# EAGLE schematic leitorcartao (EAGLE 6.3)

## Sheet 1 of 5
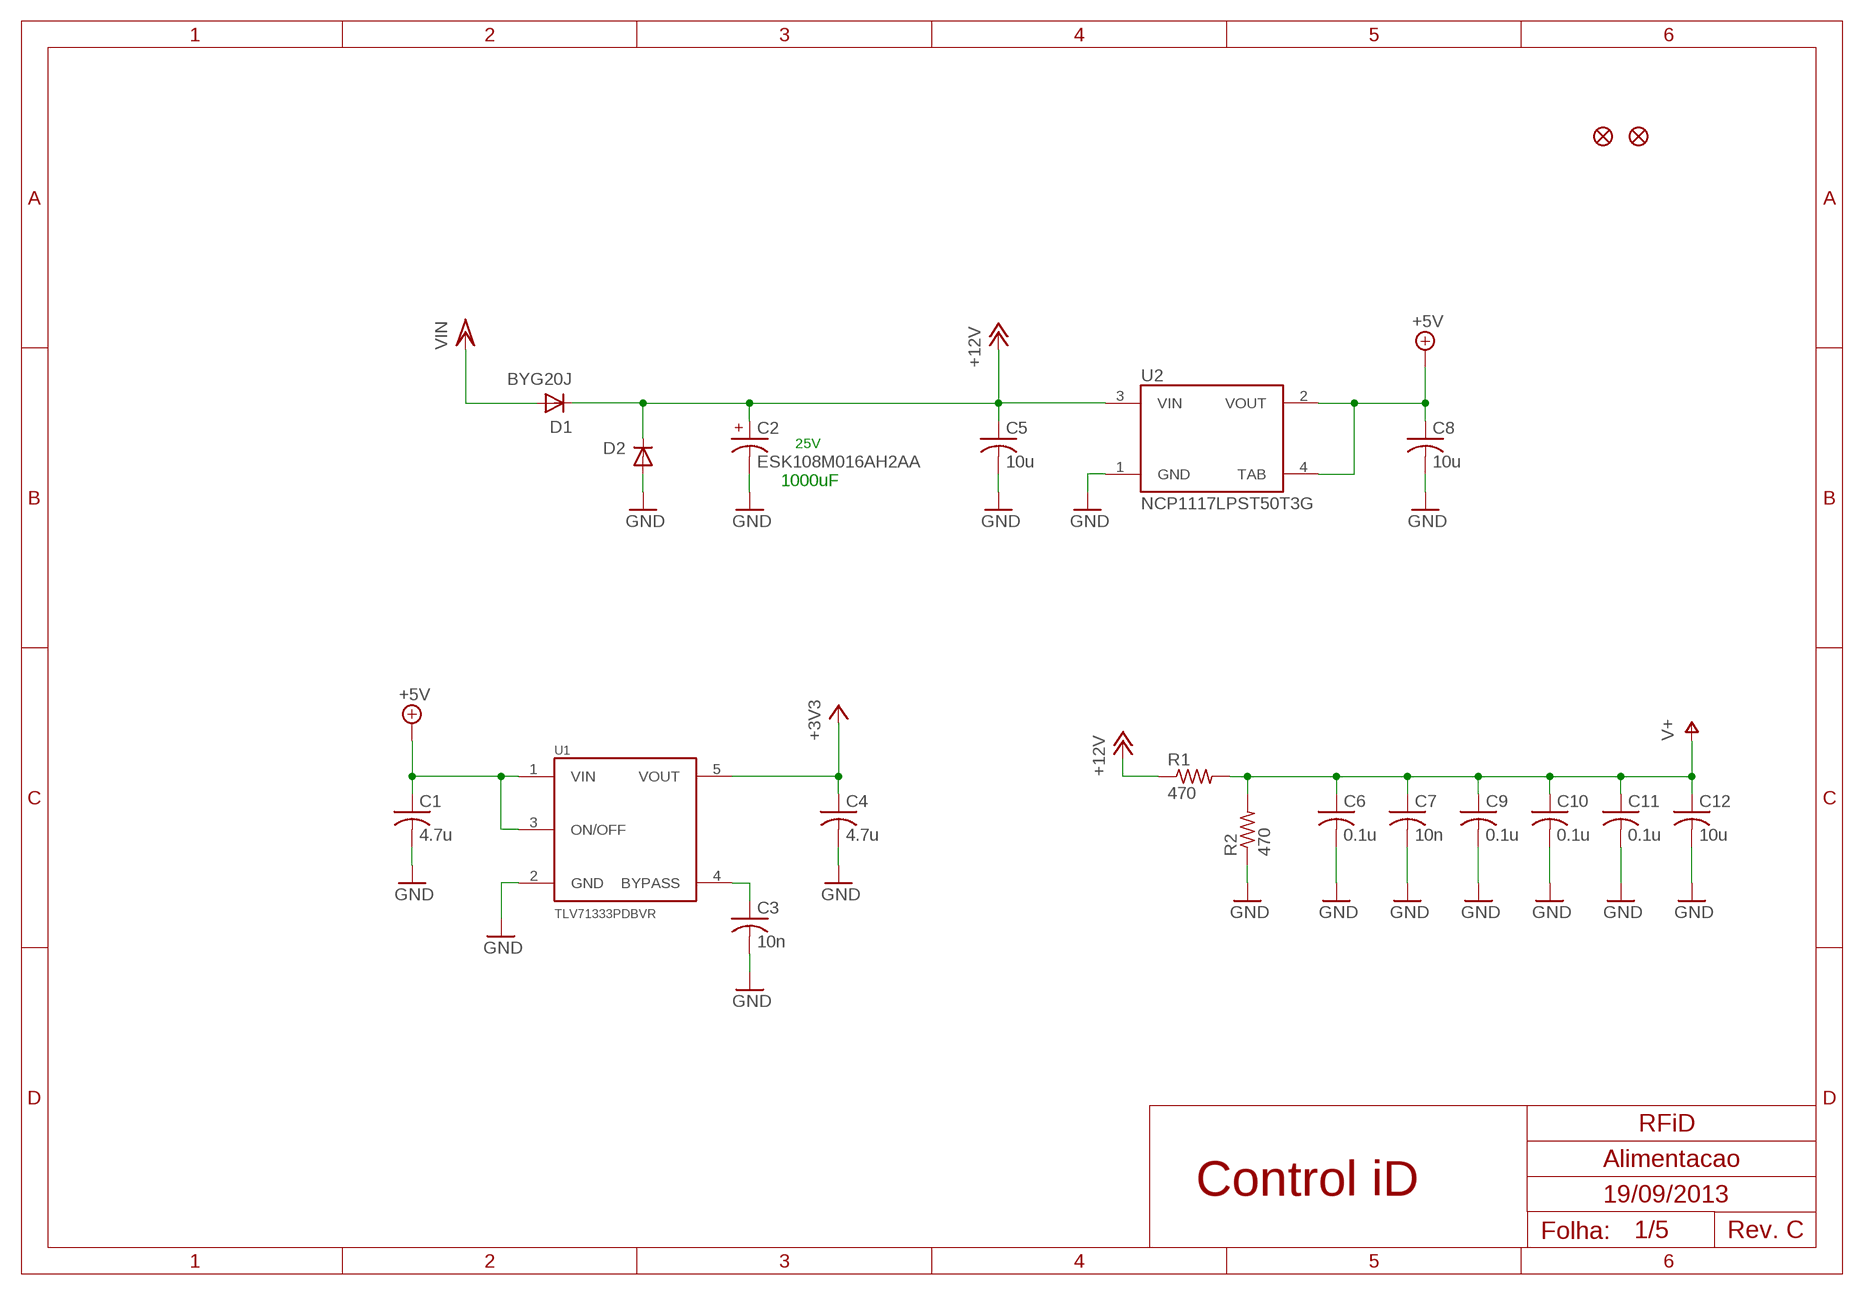
[diagram p0: schematic, sheet 1]

### Parts
C1  4.7u  C-USC0603  [C0603]
C2  ESK108M016AH2AA  [ESK108M016AH2AA]
C3  10n  C-USC0402  [C0402]
C4  4.7u  C-USC0603  [C0603]
C5  10u  C-USC0805  [C0805]
C6  0.1u  C-USC0402  [C0402]
C7  10n  C-USC0402  [C0402]
C8  10u  C-USC0805  [C0805]
C9  0.1u  C-USC0402  [C0402]
C10  0.1u  C-USC0402  [C0402]
C11  0.1u  C-USC0402  [C0402]
C12  10u  C-USC0805  [C0805]
D1  BYG20J  [SMA]
D2  DIODE-DO214AC  [DO214AC]
FID1  FIDUCIAL1.5X3  [FIDUCIAL-1.5X3]
FID3  FIDUCIAL1.5X3  [FIDUCIAL-1.5X3]
R1  470  R-US_R0402  [R0402]
R2  470  R-US_R0402  [R0402]
U1  TLV71333PDBVR  LP2985-33DBVR  [SOT-23-5]
U2  NCP1117LPST50T3G  TLV1117-50CDCYR  [SOT223-3L]

### Nets
+3V3: C4.1 U1.5(VOUT) ; also sheet 2,4,5
+5V: C1.1 C8.1 U1.1(VIN) U1.3(ON/OFF) U2.2(VOUT) U2.4(TAB) ; also sheet 5
+12V: C2.+ C5.1 D1.K D2.C R1.1 U2.3(VIN) ; also sheet 3,5
GND: C1.2 C2.- C3.2 C4.2 C5.2 C6.2 C7.2 C8.2 C9.2 C10.2 C11.2 C12.2 D2.A R2.1 U1.2(GND) U2.1(GND) ; also sheet 2,3,4,5
N$65: C3.1 U1.4(BYPASS)
V+: C6.1 C7.1 C9.1 C10.1 C11.1 C12.1 R1.2 R2.2 ; also sheet 3
VCC/2: D1.A ; supply symbol labelled VIN ; also sheet 5

### Notes on the sheet
- 25V
- 1000uF
- RFiD
- Alimentacao
- 19/09/2013
- Rev. C

## Sheet 2 of 5
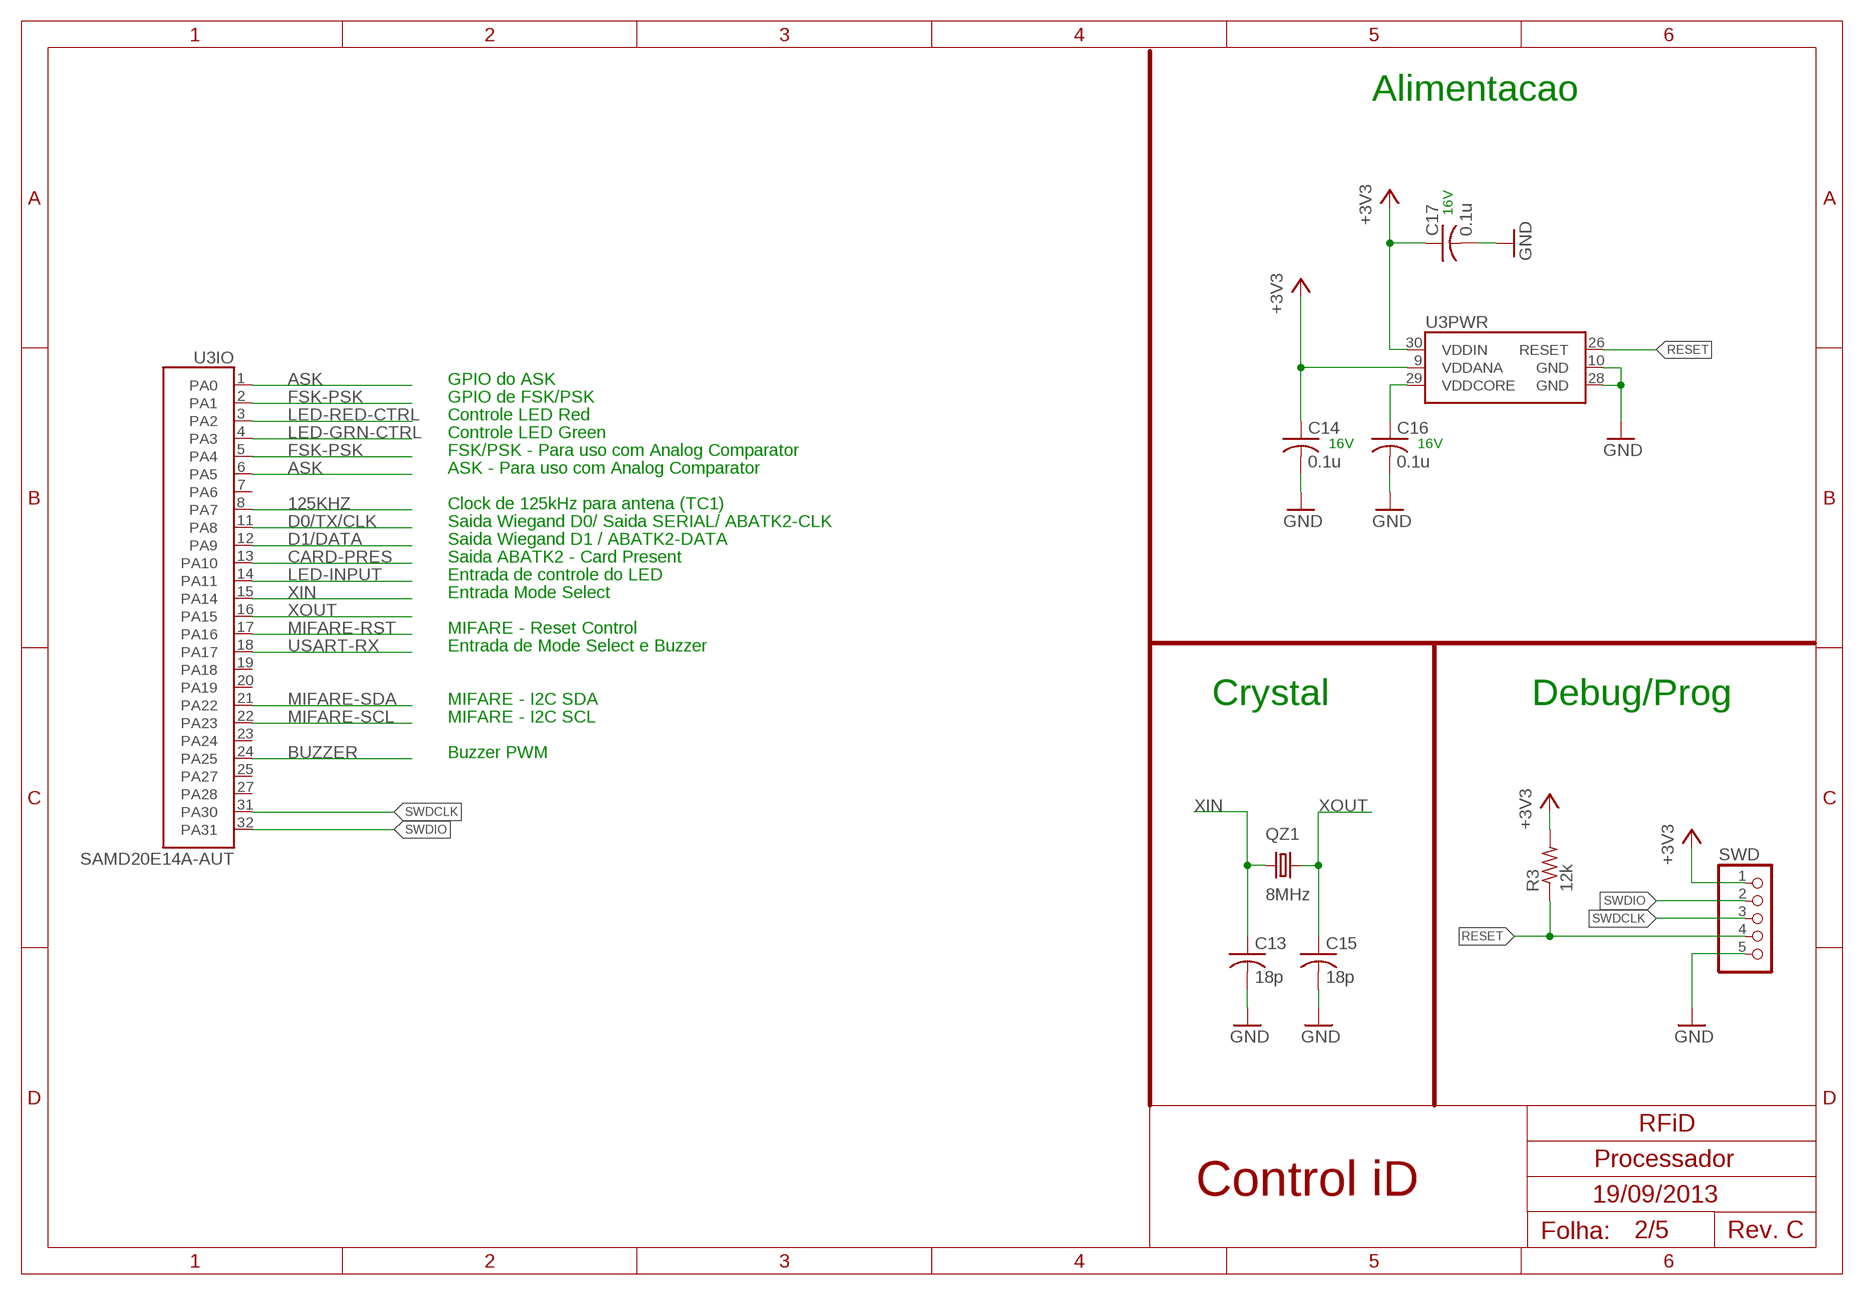
[diagram p1: schematic, sheet 2]

### Parts
C13  18p  C-USC0603  [C0603]
C14  0.1u  C-USC0402  [C0402]
C15  18p  C-USC0603  [C0603]
C16  0.1u  C-USC0402  [C0402]
C17  0.1u  C-USC0402  [C0402]
QZ1  8MHz  CRYSTALHC49S  [HC49/S]
R3  12k  R-US_R0402  [R0402]
SWD  PINHD-1X5  [1X05]
U3  SAMD20E14A-AUT  [TQFP32]

### Nets
125KHZ: U3.8(IO:PA7) ; also sheet 3
+3V3: C14.1 C17.1 R3.2 SWD.1 U3.9(PWR:VDDANA) U3.30(PWR:VDDIN) ; also sheet 1,4,5
ASK: U3.1(IO:PA0) U3.6(IO:PA5) ; also sheet 3
BUZZER: U3.24(IO:PA25) ; also sheet 5
CARD-PRES: U3.13(IO:PA10) ; also sheet 5
D0/TX/CLK: U3.11(IO:PA8) ; also sheet 5
D1/DATA: U3.12(IO:PA9) ; also sheet 5
FSK-PSK: U3.2(IO:PA1) U3.5(IO:PA4) ; also sheet 3
GND: C13.2 C14.2 C15.2 C16.2 C17.2 SWD.5 U3.10(PWR:GND) U3.28(PWR:GND) ; also sheet 1,3,4,5
LED-GRN-CTRL: U3.4(IO:PA3) ; also sheet 5
LED-INPUT: U3.14(IO:PA11) ; also sheet 5
LED-RED-CTRL: U3.3(IO:PA2) ; also sheet 5
MIFARE-RST: U3.17(IO:PA16) ; also sheet 4
MIFARE-SCL: U3.22(IO:PA23) ; also sheet 4
MIFARE-SDA: U3.21(IO:PA22) ; also sheet 4
N$47: C16.1 U3.29(PWR:VDDCORE)
RESET: R3.1 SWD.4 U3.26(PWR:RESET)
SWDCLK: SWD.3 U3.31(IO:PA30)
SWDIO: SWD.2 U3.32(IO:PA31)
USART-RX: U3.18(IO:PA17) ; also sheet 5
XIN: C13.1 QZ1.1 U3.15(IO:PA14)
XOUT: C15.1 QZ1.2 U3.16(IO:PA15)
Unconnected: U3.7(IO:PA6) U3.19(IO:PA18) U3.20(IO:PA19) U3.23(IO:PA24) U3.25(IO:PA27) U3.27(IO:PA28)

### Notes on the sheet
- Alimentacao
- 16V
- GPIO do ASK
- GPIO de FSK/PSK
- Controle LED Red
- Controle LED Green | 16V | 16V
- FSK/PSK - Para uso com Analog Comparator
- ASK - Para uso com Analog Comparator
- Clock de 125kHz para antena (TC1)
- Saida Wiegand D0/ Saida SERIAL/ ABATK2-CLK
- Saida Wiegand D1 / ABATK2-DATA
- Saida ABATK2 - Card Present
- Entrada de controle do LED
- Entrada Mode Select
- MIFARE - Reset Control
- Entrada de Mode Select e Buzzer
- MIFARE - I2C SDA | Crystal | Debug/Prog
- MIFARE - I2C SCL
- Buzzer PWM
- RFiD
- Processador
- 19/09/2013
- Rev. C

## Sheet 3 of 5
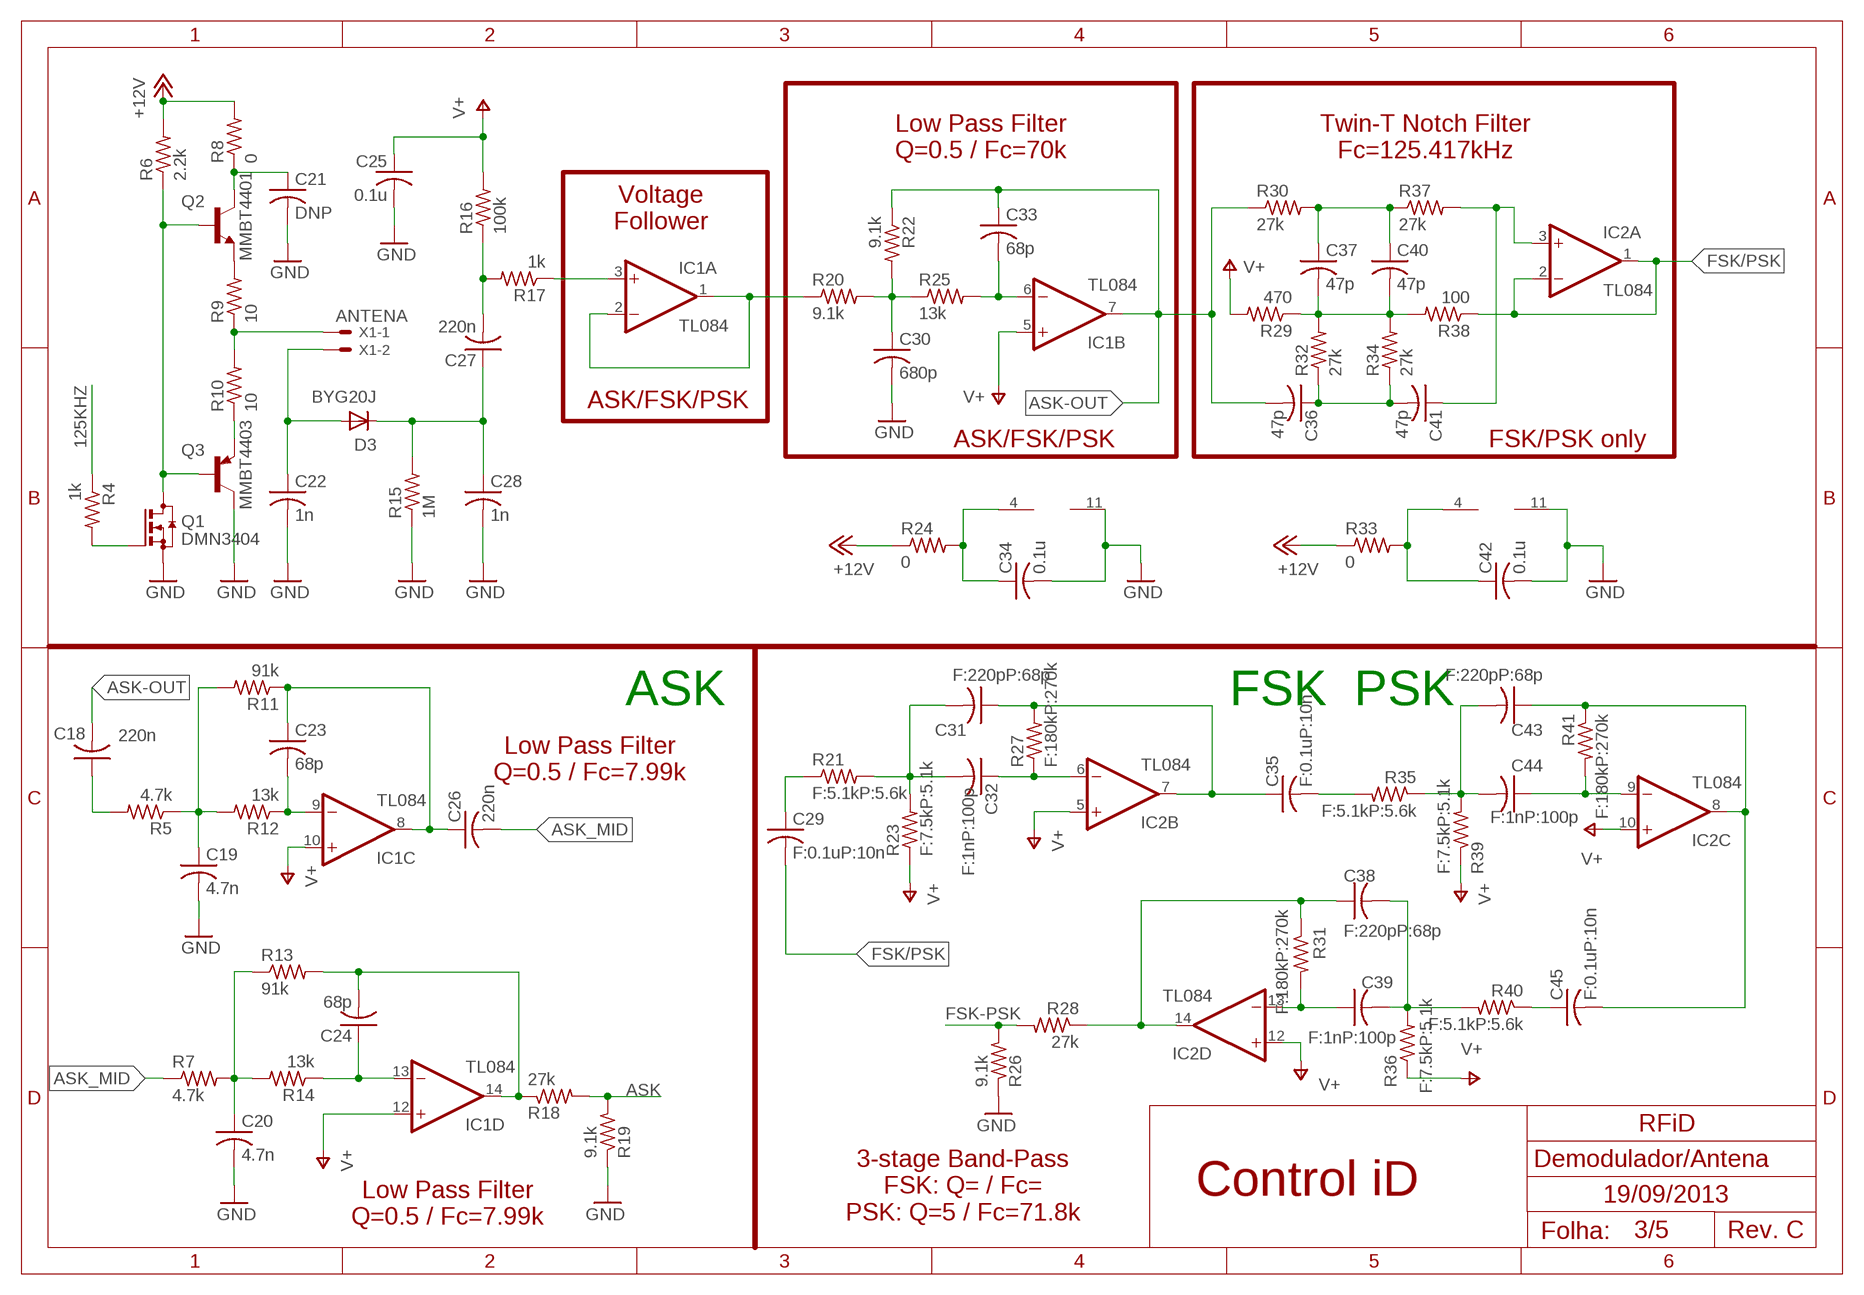
[diagram p2: schematic, sheet 3]

### Parts
C18  220n  C-USC0402  [C0402]
C19  4.7n  C-USC0402  [C0402]
C20  4.7n  C-USC0402  [C0402]
C21  DNP  C-USC0603  [C0603]
C22  1n  C-USC1812S  [C1812S]
C23  68p  C-USC0402  [C0402]
C24  68p  C-USC0402  [C0402]
C25  0.1u  C-USC0402  [C0402]
C26  220n  C-USC0402  [C0402]
C27  220n  C-USC1206S  [C1206S]
C28  1n  C-USC1206S  [C1206S]
C29  F:0.1uP:10n  C-USC0402  [C0402]
C30  680p  C-USC0402  [C0402]
C31  F:220pP:68p  C-USC0402  [C0402]
C32  F:1nP:100p  C-USC0402  [C0402]
C33  68p  C-USC0402  [C0402]
C34  0.1u  C-USC0402  [C0402]
C35  F:0.1uP:10n  C-USC0402  [C0402]
C36  47p  C-USC0402  [C0402]
C37  47p  C-USC0402  [C0402]
C38  F:220pP:68p  C-USC0402  [C0402]
C39  F:1nP:100p  C-USC0402  [C0402]
C40  47p  C-USC0402  [C0402]
C41  47p  C-USC0402  [C0402]
C42  0.1u  C-USC0402  [C0402]
C43  F:220pP:68p  C-USC0402  [C0402]
C44  F:1nP:100p  C-USC0402  [C0402]
C45  F:0.1uP:10n  C-USC0402  [C0402]
D3  BYG20J  [SMA]
IC1  TL084  [TSSOP14]
IC2  TL084  [TSSOP14]
Q1  DMN3404  [SOT23]
Q2  MMBT4401  [SOT23]
Q3  MMBT4403  [SOT23]
R4  1k  R-US_R0402  [R0402]
R5  4.7k  R-US_R0402  [R0402]
R6  2.2k  R-US_R0402  [R0402]
R7  4.7k  R-US_R0402  [R0402]
R8  0  R-US_R0402  [R0402]
R9  10  R-US_R0603  [R0603]
R10  10  R-US_R0603  [R0603]
R11  91k  R-US_R0402  [R0402]
R12  13k  R-US_R0402  [R0402]
R13  91k  R-US_R0402  [R0402]
R14  13k  R-US_R0402  [R0402]
R15  1M  R-US_R1206S  [R1206S]
R16  100k  R-US_R0603  [R0603]
R17  1k  R-US_R0402  [R0402]
R18  27k  R-US_R0402  [R0402]
R19  9.1k  R-US_R0402  [R0402]
R20  9.1k  R-US_R0402  [R0402]
R21  F:5.1kP:5.6k  R-US_R0402  [R0402]
R22  9.1k  R-US_R0402  [R0402]
R23  F:7.5kP:5.1k  R-US_R0402  [R0402]
R24  0  R-US_R0402  [R0402]
R25  13k  R-US_R0402  [R0402]
R26  9.1k  R-US_R0402  [R0402]
R27  F:180kP:270k  R-US_R0402  [R0402]
R28  27k  R-US_R0402  [R0402]
R29  470  R-US_R0402  [R0402]
R30  27k  R-US_R0402  [R0402]
R31  F:180kP:270k  R-US_R0402  [R0402]
R32  27k  R-US_R0402  [R0402]
R33  0  R-US_R0402  [R0402]
R34  27k  R-US_R0402  [R0402]
R35  F:5.1kP:5.6k  R-US_R0402  [R0402]
R36  F:7.5kP:5.1k  R-US_R0402  [R0402]
R37  27k  R-US_R0402  [R0402]
R38  100  R-US_R0603  [R0603]
R39  F:7.5kP:5.1k  R-US_R0402  [R0402]
R40  F:5.1kP:5.6k  R-US_R0402  [R0402]
R41  F:180kP:270k  R-US_R0402  [R0402]
X1  ANTENA  22-23-2021  [22-23-2021]

### Nets
125KHZ: R4.1 ; also sheet 2
+12V: R6.2 R8.2 R24.1 R33.1 ; also sheet 1,5
ASK: R18.2 R19.2 ; also sheet 2
ASK-OUT: C18.2 C33.1 C36.2 IC1.7(B:OUT) R22.1 R30.1
ASK_MID: C26.2 R7.1
FSK-PSK: R26.2 R28.2 ; also sheet 2
FSK/PSK: C29.2 IC2.1(A:OUT) IC2.2(A:-IN) R38.1
GND: C19.2 C20.2 C21.2 C22.2 C25.2 C28.2 C30.2 C34.2 C42.2 IC1.11(P:V-) IC2.11(P:V-) Q1.2(S) Q3.3(C) R15.1 R19.1 R26.1 ; also sheet 1,2,4,5
N$7: Q1.3(D) Q2.1(B) Q3.1(B) R6.1
N$8: Q1.1(G) R4.2
N$9: C22.1 D3.A X1.2
N$10: IC1.1(A:OUT) IC1.2(A:-IN) R20.1
N$11: R9.1 R10.2 X1.1
N$12: C30.1 R20.2 R22.2 R25.1
N$13: C27.1 C28.1 D3.K R15.2
N$14: C27.2 R16.1 R17.2
N$15: C33.2 IC1.6(B:-IN) R25.2
N$16: Q2.2(E) R9.2
N$17: C37.2 C40.2 R29.1 R32.2 R34.2 R38.2
N$19: C37.1 C40.1 R30.2 R37.1
N$20: C36.1 C41.2 R32.1 R34.1
N$21: C18.1 R5.2
N$22: C19.1 R5.1 R11.2 R12.2
N$23: C41.1 IC2.3(A:+IN) R37.2
N$24: C38.1 IC2.14(D:OUT) R28.1 R31.1
N$25: C35.2 R35.2
N$26: C39.1 IC2.13(D:-IN) R31.2
N$27: C23.2 IC1.9(C:-IN) R12.1
N$28: C31.2 C32.2 R21.2 R23.2
N$29: C38.2 C39.2 R36.2 R40.2
N$30: C45.1 R40.1
N$40: C43.1 C45.2 IC2.8(C:OUT) R41.1
N$48: C21.1 Q2.3(C) R8.1
N$49: C34.1 IC1.4(P:V+) R24.2
N$56: C23.1 C26.1 IC1.8(C:OUT) R11.1
N$57: C42.1 IC2.4(P:V+) R33.2
N$58: IC1.3(A:+IN) R17.1
N$60: Q3.2(E) R10.1
N$63: C20.1 R7.2 R13.1 R14.2
N$64: C24.1 IC1.13(D:-IN) R14.1
N$69: C29.1 R21.1
N$71: C31.1 C35.1 IC2.7(B:OUT) R27.2
N$72: C32.1 IC2.6(B:-IN) R27.1
N$74: C43.2 C44.2 R35.1 R39.2
N$75: C44.1 IC2.9(C:-IN) R41.2
N$90: C24.2 IC1.14(D:OUT) R13.2 R18.1
V+: C25.1 IC1.5(B:+IN) IC1.10(C:+IN) IC1.12(D:+IN) IC2.5(B:+IN) IC2.10(C:+IN) IC2.12(D:+IN) R16.2 R23.1 R29.2 R36.1 R39.1 ; also sheet 1

### Notes on the sheet
- Low Pass Filter
  Q=0.5 / Fc=70k
- Twin-T Notch Filter
  Fc=125.417kHz
- Voltage
  Follower
- ASK/FSK/PSK
- ASK/FSK/PSK | FSK/PSK only
- ASK | FSK | PSK
- Low Pass Filter
  Q=0.5 / Fc=7.99k
- RFiD
- Demodulador/Antena
- 3-stage Band-Pass
  FSK: Q= / Fc=
  PSK: Q=5 / Fc=71.8k
- Low Pass Filter
  Q=0.5 / Fc=7.99k
- 19/09/2013
- Rev. C

## Sheet 4 of 5
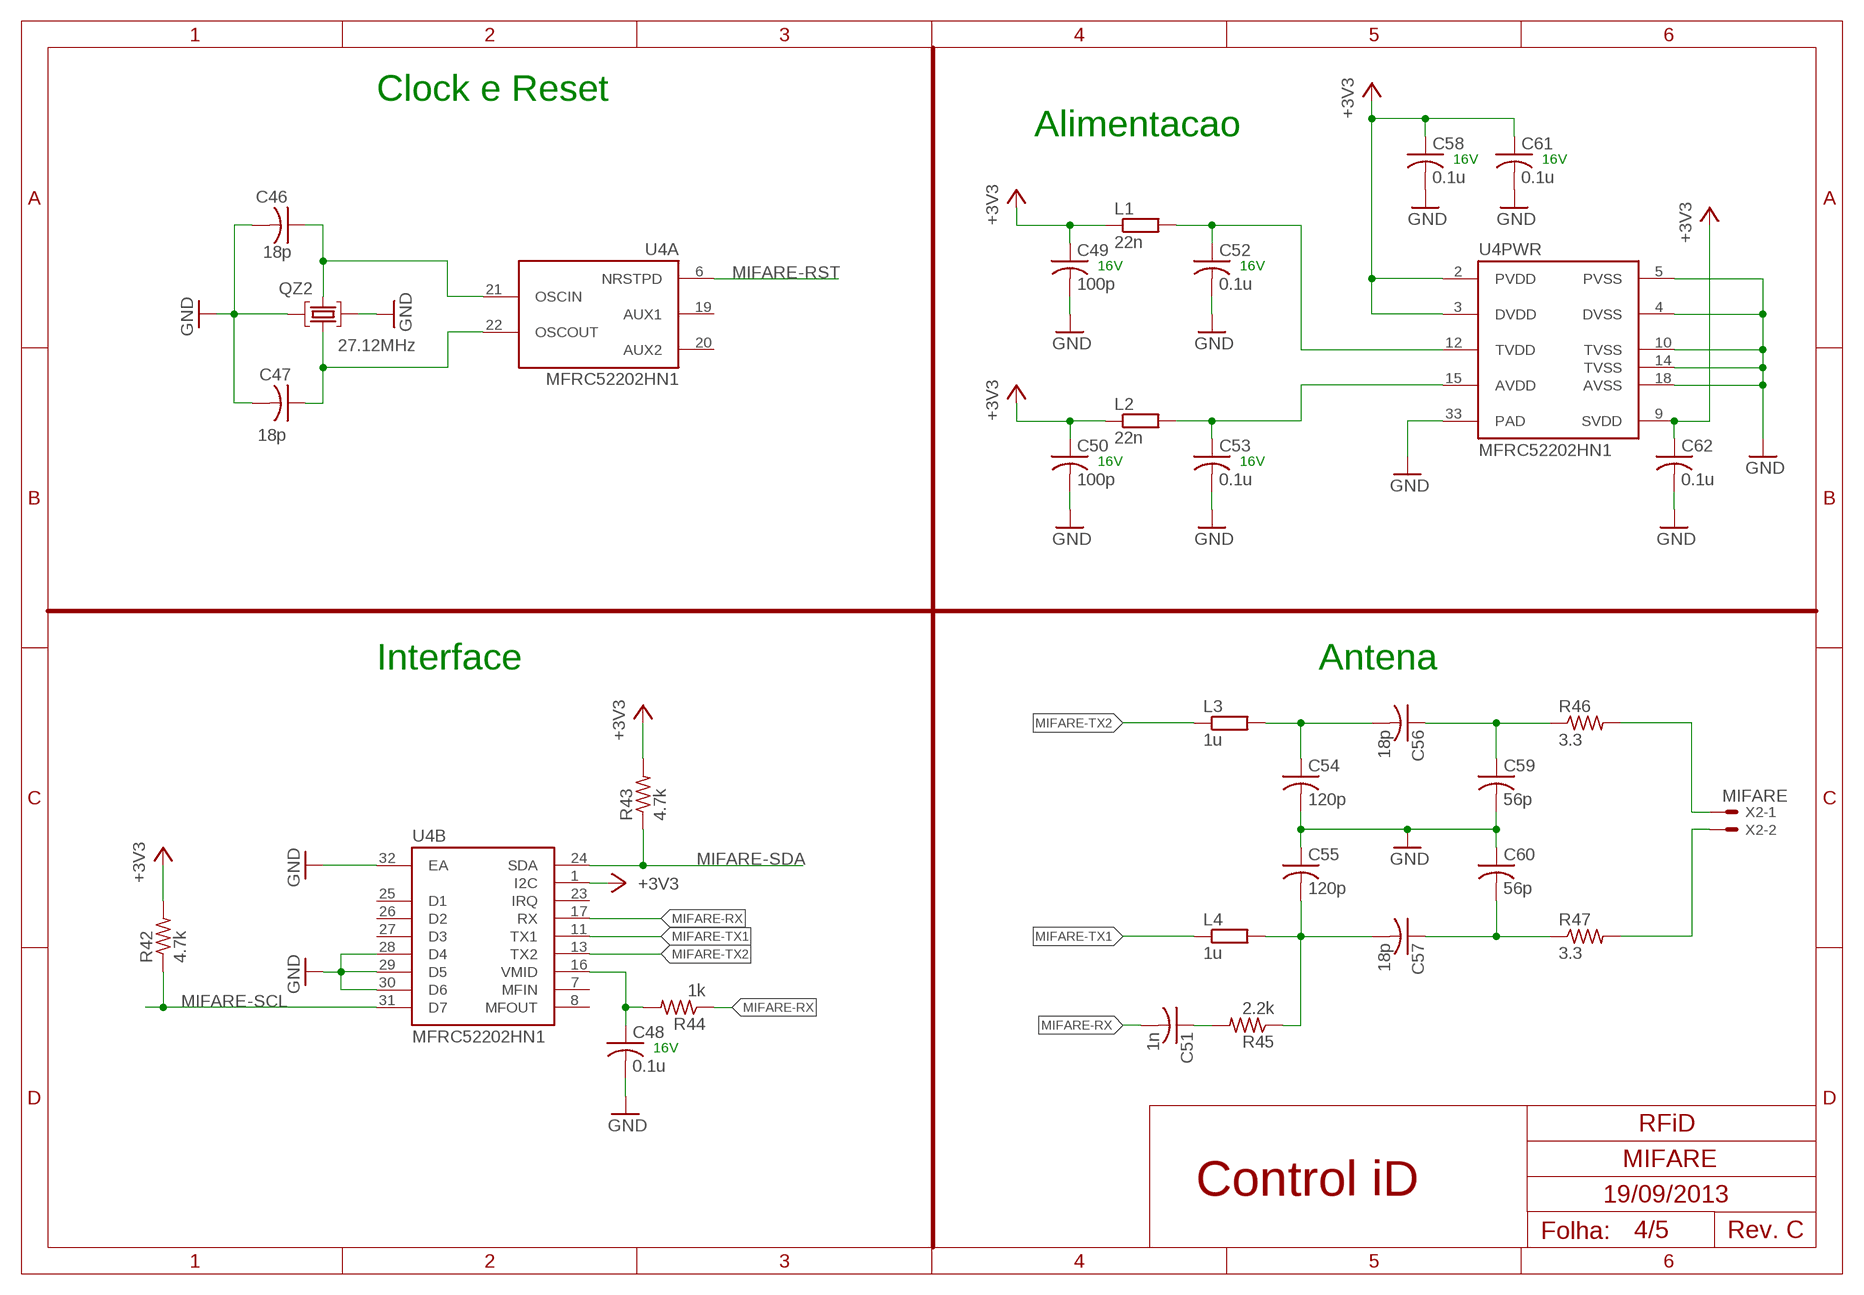
[diagram p3: schematic, sheet 4]

### Parts
C46  18p  C-USC0603  [C0603]
C47  18p  C-USC0603  [C0603]
C48  0.1u  C-USC0402  [C0402]
C49  100p  C-USC0402  [C0402]
C50  100p  C-USC0402  [C0402]
C51  1n  C-USC0402  [C0402]
C52  0.1u  C-USC0402  [C0402]
C53  0.1u  C-USC0402  [C0402]
C54  120p  C-USC0603  [C0603]
C55  120p  C-USC0603  [C0603]
C56  18p  C-USC0603  [C0603]
C57  18p  C-USC0603  [C0603]
C58  0.1u  C-USC0402  [C0402]
C59  56p  C-USC0603  [C0603]
C60  56p  C-USC0603  [C0603]
C61  0.1u  C-USC0402  [C0402]
C62  0.1u  C-USC0402  [C0402]
L1  22n  R-EU_R0402  [R0402]
L2  22n  R-EU_R0402  [R0402]
L3  1u  R-EU_R0603  [R0603]
L4  1u  R-EU_R0603  [R0603]
QZ2  27.12MHz  CRISTAL  [CRISTAL4SMD]
R42  4.7k  R-US_R0402  [R0402]
R43  4.7k  R-US_R0402  [R0402]
R44  1k  R-US_R0402  [R0402]
R45  2.2k  R-US_R0402  [R0402]
R46  3.3  R-US_R0603  [R0603]
R47  3.3  R-US_R0603  [R0603]
U4  MFRC52202HN1  [QFN32]
X2  MIFARE  ANTENA  [ANTENNA]

### Nets
+3V3: C49.1 C50.1 C58.1 C61.1 C62.1 L1.1 L2.1 R42.2 R43.2 U4.1(B:I2C) U4.2(PWR:PVDD) U4.3(PWR:DVDD) U4.9(PWR:SVDD) ; also sheet 1,2,5
GND: C46.2 C47.2 C48.2 C49.2 C50.2 C52.2 C53.2 C54.2 C55.1 C58.2 C59.2 C60.1 C61.2 C62.2 QZ2.2(GND) QZ2.4(GND) U4.4(PWR:DVSS) U4.5(PWR:PVSS) U4.10(PWR:TVSS) U4.14(PWR:TVSS) U4.18(PWR:AVSS) U4.28(B:D4) U4.29(B:D5) U4.30(B:D6) U4.32(B:EA) U4.33(PWR:PAD) ; also sheet 1,2,3,5
MIFARE-RST: U4.6(A:NRSTPD) ; also sheet 2
MIFARE-RX: C51.2 R44.1 U4.17(B:RX)
MIFARE-SCL: R42.1 U4.31(B:D7) ; also sheet 2
MIFARE-SDA: R43.1 U4.24(B:SDA) ; also sheet 2
MIFARE-TX1: L4.1 U4.11(B:TX1)
MIFARE-TX2: L3.1 U4.13(B:TX2)
N$2: C52.1 L1.2 U4.12(PWR:TVDD)
N$3: C46.1 QZ2.3 U4.21(A:OSCIN)
N$4: C53.1 L2.2 U4.15(PWR:AVDD)
N$5: C47.1 QZ2.1 U4.22(A:OSCOUT)
N$31: C55.2 C57.2 L4.2 R45.1
N$33: C57.1 C60.2 R47.1
N$34: C54.1 C56.2 L3.2
N$35: C56.1 C59.1 R46.1
N$36: C51.1 R45.2
N$37: C48.1 R44.2 U4.16(B:VMID)
N$38: R46.2 X2.1
N$39: R47.2 X2.2
Unconnected: U4.7(B:MFIN) U4.8(B:MFOUT) U4.19(A:AUX1) U4.20(A:AUX2) U4.23(B:IRQ) U4.25(B:D1) U4.26(B:D2) U4.27(B:D3)

### Notes on the sheet
- Clock e Reset
- Alimentacao
- 16V | 16V
- 16V | 16V
- 16V | 16V
- Interface | Antena
- 16V
- RFiD
- MIFARE
- 19/09/2013
- Rev. C

## Sheet 5 of 5
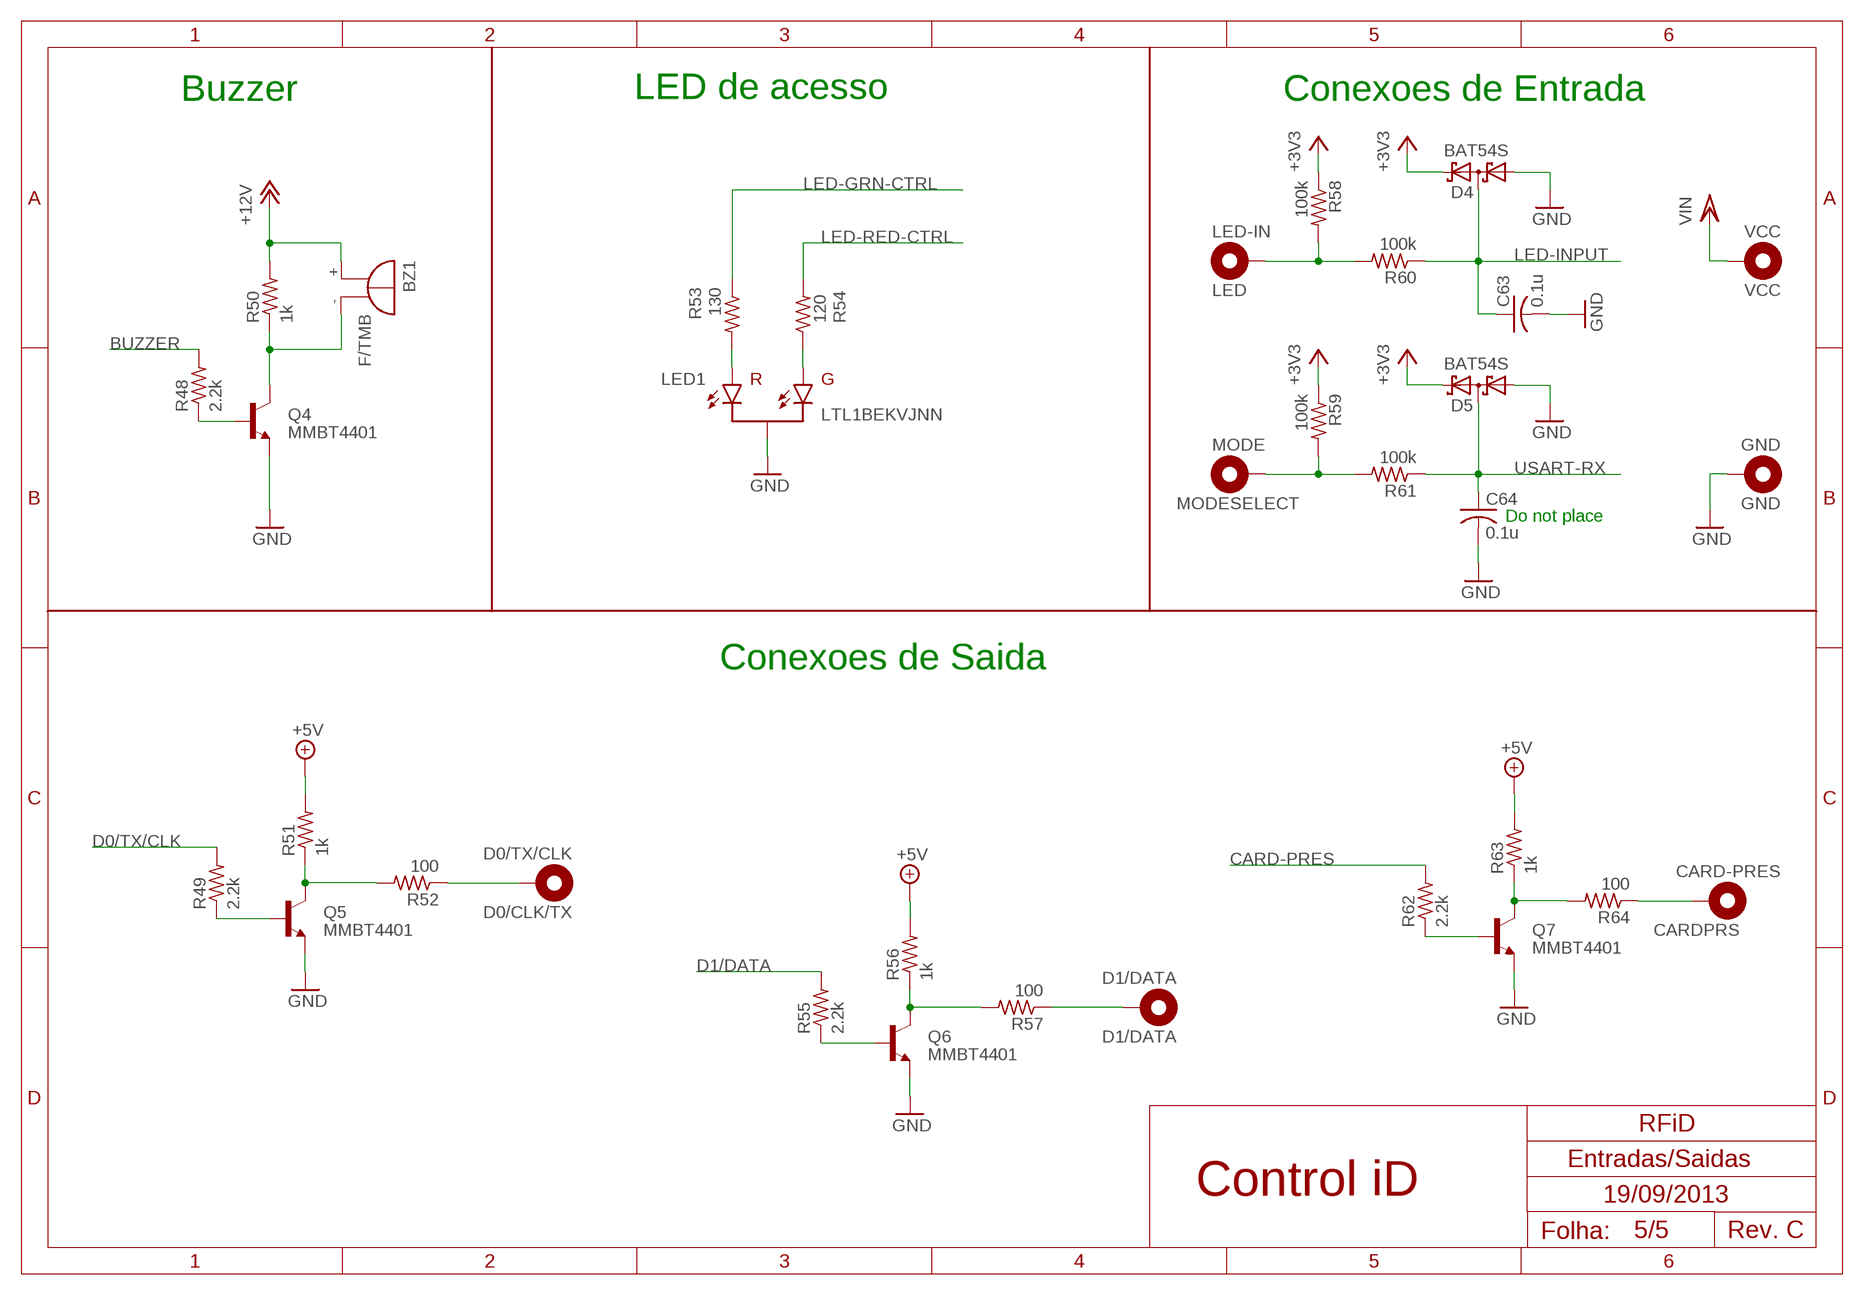
[diagram p4: schematic, sheet 5]

### Parts
BZ1  F/TMB  [F/TMB]
C63  0.1u  C-USC0402  [C0402]
C64  0.1u  C-USC0402  [C0402]
CARDPRS  CARD-PRES  PTHPAD  [HOLE]
D0/TX/CLK  D0/CLK/TX  PTHPAD  [HOLE]
D1/DATA  D1/DATA  PTHPAD  [HOLE]
D4  BAT54S  [SOT23]
D5  BAT54S  [SOT23]
GND  GND  PTHPAD  [HOLE]
LED1  LTL1BEKVJNN  [LTL1BEKVJNN]
LED-IN  LED  PTHPAD  [HOLE]
MODE  MODESELECT  PTHPAD  [HOLE]
Q4  MMBT4401  [SOT23]
Q5  MMBT4401  [SOT23]
Q6  MMBT4401  [SOT23]
Q7  MMBT4401  [SOT23]
R48  2.2k  R-US_R0402  [R0402]
R49  2.2k  R-US_R0402  [R0402]
R50  1k  R-US_R0402  [R0402]
R51  1k  R-US_R0402  [R0402]
R52  100  R-US_R0603  [R0603]
R53  130  R-US_R0402  [R0402]
R54  120  R-US_R0402  [R0402]
R55  2.2k  R-US_R0402  [R0402]
R56  1k  R-US_R0402  [R0402]
R57  100  R-US_R0603  [R0603]
R58  100k  R-US_R0603  [R0603]
R59  100k  R-US_R0603  [R0603]
R60  100k  R-US_R0603  [R0603]
R61  100k  R-US_R0603  [R0603]
R62  2.2k  R-US_R0402  [R0402]
R63  1k  R-US_R0402  [R0402]
R64  100  R-US_R0603  [R0603]
VCC  VCC  PTHPAD  [HOLE]

### Nets
+3V3: D4.2(C2) D5.2(C2) R58.1 R59.1 ; also sheet 1,2,4
+5V: R51.2 R56.2 R63.2 ; also sheet 1
+12V: BZ1.+ R50.2 ; also sheet 1,3
BUZZER: R48.2 ; also sheet 2
CARD-PRES: R62.2 ; also sheet 2
D0/TX/CLK: R49.2 ; also sheet 2
D1/DATA: R55.2 ; also sheet 2
GND: C63.2 C64.2 D4.1(A1) D5.1(A1) GND.P$1 LED1.COMMON Q4.2(E) Q5.2(E) Q6.2(E) Q7.2(E) ; also sheet 1,2,3,4
LED-GRN-CTRL: R53.1 ; also sheet 2
LED-INPUT: C63.1 D4.3(C1A2) R60.1 ; also sheet 2
LED-RED-CTRL: R54.2 ; also sheet 2
N$6: Q6.1(B) R55.1
N$18: LED-IN.P$1 R58.2 R60.2
N$32: Q5.1(B) R49.1
N$41: Q6.3(C) R56.1 R57.2
N$42: Q7.3(C) R63.1 R64.2
N$43: MODE.P$1 R59.2 R61.2
N$44: Q7.1(B) R62.1
N$45: Q5.3(C) R51.1 R52.2
N$46: D0/TX/CLK.P$1 R52.1
N$50: D1/DATA.P$1 R57.1
N$51: CARDPRS.P$1 R64.1
N$52: LED1.ANODE_RED R53.2
N$53: LED1.ANODE_GRN R54.1
N$54: BZ1.- Q4.3(C) R50.1
N$55: Q4.1(B) R48.1
USART-RX: C64.1 D5.3(C1A2) R61.1 ; also sheet 2
VCC/2: VCC.P$1 ; supply symbol labelled VIN ; also sheet 1

### Notes on the sheet
- Buzzer | LED de acesso | Conexoes de Entrada
- Do not place
- Conexoes de Saida
- RFiD
- Entradas/Saidas
- 19/09/2013
- Rev. C

## Library data of the parts
BZ1 = RFiD:F/TMB: BUZZER Source: Buerklin; ASK: X; ASK_CUSTOMERPN: BUZ-REP; ASK_PN: PS1240P02BT; FSK: X; FSK_CUSTOMERPN: BUZ-REP; FSK_PN: PS1240P02BT; MIFARE: X; MIFARE_CUSTOMERPN: BUZ-REP; MIFARE_PN: PS1240P02BT; PSK: X; PSK_CUSTOMERPN: BUZ-REP; PSK_PN: PS1240P02BT
C1 C4 = RFiD:C-US: CAPACITOR, American symbol; ASK: X; ASK_CUSTOMERPN: C/4.7u/16V/C06; ASK_PN: CL10A475KO8NNNC; FSK: X; FSK_CUSTOMERPN: C/4.7u/16V/C06; FSK_PN: CL10A475KO8NNNC; MIFARE: X; MIFARE_CUSTOMERPN: C/4.7u/16V/C06; MIFARE_PN: CL10A475KO8NNNC; PASSIVO: Sim; PSK: X; PSK_CUSTOMERPN: C/4.7u/16V/C06; PSK_PN: CL10A475KO8NNNC
C2 = RFiD:ESK108M016AH2AA; ASK: X; ASK_CUSTOMERPN: C/1m/16V/PTH; ASK_PN: ESK108M016AH2AA; FSK: X; FSK_CUSTOMERPN: C/1m/16V/PTH; FSK_PN: ESK108M016AH2AA; MIFARE: X; MIFARE_CUSTOMERPN: C/1m/16V/PTH; MIFARE_PN: ESK108M016AH2AA; PASSIVO: Sim; PSK: X; PSK_CUSTOMERPN: C/1m/16V/PTH; PSK_PN: ESK108M016AH2AA
C3 C7 = RFiD:C-US: CAPACITOR, American symbol; ASK: X; ASK_CUSTOMERPN: C/10n/50V/C04; ASK_PN: CL05B103KB5NNNC; FSK: X; FSK_CUSTOMERPN: C/10n/50V/C04; FSK_PN: CL05B103KB5NNNC; MIFARE: X; MIFARE_CUSTOMERPN: C/10n/50V/C04; MIFARE_PN: CL05B103KB5NNNC; PASSIVO: Sim; PSK: X; PSK_CUSTOMERPN: C/10n/50V/C04; PSK_PN: CL05B103KB5NNNC
C5 C8 C12 = RFiD:C-US: CAPACITOR, American symbol; ASK: X; ASK_CUSTOMERPN: C/10u/25V/A08; ASK_PN: GRM188R61E106MA73D; FSK: X; FSK_CUSTOMERPN: C/10u/25V/A08; FSK_PN: GRM188R61E106MA73D; MIFARE: X; MIFARE_CUSTOMERPN: C/10u/25V/A08; MIFARE_PN: GRM188R61E106MA73D; PASSIVO: Sim; PSK: X; PSK_CUSTOMERPN: C/10u/25V/A08; PSK_PN: GRM188R61E106MA73D
C6 C9-C11 C14 C16 C17 C25 C34 C42 C63 = RFiD:C-US: CAPACITOR, American symbol; ASK: X; ASK_CUSTOMERPN: C/0.1u/16V/A04; ASK_PN: CL05B104KO5NNNC; FSK: X; FSK_CUSTOMERPN: C/0.1u/16V/A04; FSK_PN: CL05B104KO5NNNC; MIFARE: X; MIFARE_CUSTOMERPN: C/0.1u/16V/A04; MIFARE_PN: CL05B104KO5NNNC; PASSIVO: Sim; PSK: X; PSK_CUSTOMERPN: C/0.1u/16V/A04; PSK_PN: CL05B104KO5NNNC
C13 C15 = RFiD:C-US: CAPACITOR, American symbol; ASK: X; ASK_CUSTOMERPN: C/18p/100V/E06; ASK_PN: 06031U180FAT2A; FSK: X; FSK_CUSTOMERPN: C/18p/100V/E06; FSK_PN: 06031U180FAT2A; MIFARE: X; MIFARE_CUSTOMERPN: C/18p/100V/E06; MIFARE_PN: 06031U180FAT2A; PASSIVO: Sim; PSK: X; PSK_CUSTOMERPN: C/18p/100V/E06; PSK_PN: 06031U180FAT2A
C18 C26 = RFiD:C-US: CAPACITOR, American symbol; ASK: X; ASK_CUSTOMERPN: C/220n/25V/C04; ASK_PN: C1005X5R1E224K050BC; FSK: X; FSK_CUSTOMERPN: C/220n/25V/C04; FSK_PN: C1005X5R1E224K050BC; MIFARE: X; MIFARE_CUSTOMERPN: C/220n/25V/C04; MIFARE_PN: C1005X5R1E224K050BC; PASSIVO: Sim; PSK: X; PSK_CUSTOMERPN: C/220n/25V/C04; PSK_PN: C1005X5R1E224K050BC
C19 C20 = RFiD:C-US: CAPACITOR, American symbol; ASK: X; ASK_CUSTOMERPN: C/4.7n/25V/D04; ASK_PN: C0402C472J3RACTU; FSK: X; FSK_CUSTOMERPN: C/4.7n/25V/D04; FSK_PN: C0402C472J3RACTU; MIFARE: X; MIFARE_CUSTOMERPN: C/4.7n/25V/D04; MIFARE_PN: C0402C472J3RACTU; PASSIVO: Sim; PSK: X; PSK_CUSTOMERPN: C/4.7n/25V/D04; PSK_PN: C0402C472J3RACTU
C21 = RFiD:C-US: CAPACITOR, American symbol; ASK: X; ASK_CUSTOMERPN: DNP; FSK: X; FSK_CUSTOMERPN: DNP; MIFARE: X; MIFARE_CUSTOMERPN: DNP; PASSIVO: Sim; PSK: X; PSK_PN: DNP
C22 = RFiD:C-US: CAPACITOR, American symbol; ASK: X; ASK_CUSTOMERPN: C/1n/500V/E18; ASK_PN: C1812C102FBGACTU; FSK: X; FSK_CUSTOMERPN: C/1n/500V/E18; FSK_PN: C1812C102FBGACTU; MIFARE: X; MIFARE_CUSTOMERPN: C/1n/500V/E18; MIFARE_PN: C1812C102FBGACTU; PASSIVO: Sim; PSK: X; PSK_CUSTOMERPN: C/1n/500V/E18; PSK_PN: C1812C102FBGACTU
C23 C24 C33 = RFiD:C-US: CAPACITOR, American symbol; ASK: X; ASK_CUSTOMERPN: C/68p/25V/D04; ASK_PN: CL05C680JB5NNNC; FSK: X; FSK_CUSTOMERPN: C/68p/25V/D04; FSK_PN: CL05C680JB5NNNC; MIFARE: X; MIFARE_CUSTOMERPN: C/68p/25V/D04; MIFARE_PN: CL05C680JB5NNNC; PASSIVO: Sim; PSK: X; PSK_CUSTOMERPN: C/68p/25V/D04; PSK_PN: CL05C680JB5NNNC
C27 = RFiD:C-US: CAPACITOR, American symbol; ASK: X; ASK_CUSTOMERPN: C/220n/200V/C12; ASK_PN: C3216X7T2E224K160AA; FSK: X; FSK_CUSTOMERPN: C/220n/200V/C12; FSK_PN: C3216X7T2E224K160AA; MIFARE: X; MIFARE_CUSTOMERPN: C/220n/200V/C12; MIFARE_PN: C3216X7T2E224K160AA; PASSIVO: Sim; PSK: X; PSK_CUSTOMERPN: C/220n/200V/C12; PSK_PN: C3216X7T2E224K160AA
C28 = RFiD:C-US: CAPACITOR, American symbol; ASK: X; ASK_CUSTOMERPN: C/1n/200V/C12; ASK_PN: CL31C102JHHNFNE; FSK: X; FSK_CUSTOMERPN: C/1n/200V/C12; FSK_PN: CL31C102JHHNFNE; MIFARE: X; MIFARE_CUSTOMERPN: C/1n/200V/C12; MIFARE_PN: CL31C102JHHNFNE; PASSIVO: Sim; PSK: X; PSK_CUSTOMERPN: C/1n/200V/C12; PSK_PN: CL31C102JHHNFNE
C29 C35 C45 = RFiD:C-US: CAPACITOR, American symbol; FSK: X; FSK_CUSTOMERPN: C/0.1u/16V/A04; FSK_PN: CL05B104KO5NNNC; PASSIVO: Sim; PSK: X; PSK_CUSTOMERPN: C/10n/50V/C04; PSK_PN: CL05B103KB5NNNC
C30 = RFiD:C-US: CAPACITOR, American symbol; ASK: X; ASK_CUSTOMERPN: C/680p/25V/C04; ASK_PN: CL05B681KB5NNNC; FSK: X; FSK_CUSTOMERPN: C/680p/25V/C04; FSK_PN: CL05B681KB5NNNC; MIFARE: X; MIFARE_CUSTOMERPN: C/680p/25V/C04; MIFARE_PN: CL05B681KB5NNNC; PASSIVO: Sim; PSK: X; PSK_CUSTOMERPN: C/680p/25V/C04; PSK_PN: CL05B681KB5NNNC
C31 C38 = RFiD:C-US: CAPACITOR, American symbol; FSK: X; FSK_CUSTOMERPN: C/220p/25V/D04; FSK_PN: CL05C221JB5NNNC; PASSIVO: Sim; PSK: X; PSK_CUSTOMERPN: C/68p/25V/D04; PSK_PN: CL05C680JB5NNNC
C32 C39 C44 = RFiD:C-US: CAPACITOR, American symbol; FSK: X; FSK_CUSTOMERPN: C/1n/25V/D04; FSK_PN: CL05B102JB5NFNC; PASSIVO: Sim; PSK: X; PSK_CUSTOMERPN: C/100p/50V/D04; PSK_PN: CL05C101JB5NNNC
C36 C37 C40 C41 = RFiD:C-US: CAPACITOR, American symbol; FSK: X; FSK_CUSTOMERPN: C/47p/25V/E04; FSK_PN: CL05C470FB5NNNC; PASSIVO: Sim; PSK: X; PSK_CUSTOMERPN: C/47p/25V/E04; PSK_PN: CL05C470FB5NNNC
C43 = RFiD:C-US: CAPACITOR, American symbol; FSK: X; FSK_CUSTOMERPN: C/220p/25V/D04; FSK_PN: CL05C221JB5NNNC; PASSIVO: Sim; PSK: X; PSK_CUSTOMERPN: C/680p/25V/C04; PSK_PN: CL05B681KB5NNNC
C46 C47 C56 C57 = RFiD:C-US: CAPACITOR, American symbol; MIFARE: X; MIFARE_CUSTOMERPN: C/18p/100V/E06; MIFARE_PN: 06031U180FAT2A; PASSIVO: Sim
C48 C52 C53 C58 C61 C62 = RFiD:C-US: CAPACITOR, American symbol; MIFARE: X; MIFARE_CUSTOMERPN: C/0.1u/16V/A04; MIFARE_PN: CL05B104KO5NNNC; PASSIVO: Sim
C49 C50 = RFiD:C-US: CAPACITOR, American symbol; MIFARE: X; MIFARE_CUSTOMERPN: C/100p/50V/D04; MIFARE_PN: CL05C101JB5NNNC; PASSIVO: Sim
C51 = RFiD:C-US: CAPACITOR, American symbol; MIFARE: X; MIFARE_CUSTOMERPN: C/1n/100V/D04; MIFARE_PN: C0402C102J1GACTU; PASSIVO: Sim
C54 C55 = RFiD:C-US: CAPACITOR, American symbol; MIFARE: X; MIFARE_CUSTOMERPN: C/120p/100V/E06; MIFARE_PN: GRM1885C2A121FA01J; PASSIVO: Sim
C59 C60 = RFiD:C-US: CAPACITOR, American symbol; MIFARE: X; MIFARE_CUSTOMERPN: C/56p/100V/E06; MIFARE_PN: 06031U560FAT2A; PASSIVO: Sim
C64 = RFiD:C-US: CAPACITOR, American symbol; ASK: X; ASK_CUSTOMERPN: DNP; ASK_PN: CL05B104KO5NNNC; FSK: X; FSK_CUSTOMERPN: DNP; FSK_PN: CL05B104KO5NNNC; MIFARE: X; MIFARE_CUSTOMERPN: DNP; MIFARE_PN: CL05B104KO5NNNC; PASSIVO: Sim; PSK: X; PSK_CUSTOMERPN: DNP; PSK_PN: CL05B104KO5NNNC
CARDPRS D0/TX/CLK D1/DATA GND LED-IN MODE VCC = RFiD:PTHPAD
D1 D3 = RFiD:BYG20J; ASK: X; ASK_CUSTOMERPN: D/BYG20J; ASK_PN: BYG20J-E3/TR; FSK: X; FSK_CUSTOMERPN: D/BYG20J; FSK_PN: BYG20J-E3/TR; MIFARE: X; MIFARE_CUSTOMERPN: D/BYG20J; MIFARE_PN: BYG20J-E3/TR; PASSIVO: Sim; PSK: X; PSK_CUSTOMERPN: D/BYG20J; PSK_PN: BYG20J-E3/TR
D2 = RFiD:DIODE-: DIODE; ASK: X; ASK_CUSTOMERPN: TVS/14V/SMA; ASK_PN: SMAJ14A; FSK: X; FSK_CUSTOMERPN: TVS/14V/SMA; FSK_PN: SMAJ14A; MIFARE: X; MIFARE_CUSTOMERPN: TVS/14V/SMA; MIFARE_PN: SMAJ14A; PASSIVO: Sim; PSK: X; PSK_CUSTOMERPN: TVS/14V/SMA; PSK_PN: SMAJ14A
D4 D5 = RFiD:BAT54S: Schottky Diodes Pin connection corrected 2011-05-04 Source: Fairchild .. BAT54.pdf; ASK: X; ASK_CUSTOMERPN: D/BAT54S/SOT23; ASK_PN: BAT54S,215; FSK: X; FSK_CUSTOMERPN: D/BAT54S/SOT23; FSK_PN: BAT54S,215; MIFARE: X; MIFARE_CUSTOMERPN: D/BAT54S/SOT23; MIFARE_PN: BAT54S,215; PSK: X; PSK_CUSTOMERPN: D/BAT54S/SOT23; PSK_PN: BAT54S,215
FID1 FID3 = RFiD:FIDUCIAL: Fiducial Alignment Points Various fiducial points for machine vision alignment.
IC1 = RFiD:TL084: OP AMP; ASK: X; ASK_CUSTOMERPN: IC/TL084/TSSOP14; ASK_PN: TL084CPT; FSK: X; FSK_CUSTOMERPN: IC/TL084/TSSOP14; FSK_PN: TL084CPT; MIFARE: X; MIFARE_CUSTOMERPN: IC/TL084/TSSOP14; MIFARE_PN: TL084CPT; PSK: X; PSK_CUSTOMERPN: IC/TL084/TSSOP14; PSK_PN: TL084CPT
IC2 = RFiD:TL084: OP AMP; FSK: X; FSK_CUSTOMERPN: IC/TL084/TSSOP14; FSK_PN: TL084CPT; PSK: X; PSK_CUSTOMERPN: IC/TL084/TSSOP14; PSK_PN: TL084CPT
L1 L2 = RFiD:R-EU_: RESISTOR, European symbol; MIFARE: X; MIFARE_CUSTOMERPN: L/22n/0.2A/04; MIFARE_PN: CIH05T22NJNC; PASSIVO: Sim
L3 L4 = RFiD:R-EU_: RESISTOR, European symbol; MIFARE: X; MIFARE_CUSTOMERPN: L/1u/0.5A/06; MIFARE_PN: BRC1608T1R0M; PASSIVO: Sim
LED1 = RFiD:LTL1BEKVJNN; ASK: X; ASK_CUSTOMERPN: LED/RG/3MM; ASK_PN: LTL1BEKVJNN; FSK: X; FSK_CUSTOMERPN: LED/RG/3MM; FSK_PN: LTL1BEKVJNN; MIFARE: X; MIFARE_CUSTOMERPN: LED/RG/3MM; MIFARE_PN: LTL1BEKVJNN; PSK: X; PSK_CUSTOMERPN: LED/RG/3MM; PSK_PN: LTL1BEKVJNN
Q1 = RFiD:DMN3404; ASK: X; ASK_CUSTOMERPN: Q/DMN3404/SOT23; ASK_PN: DMN3404L-7; FSK: X; FSK_CUSTOMERPN: Q/DMN3404/SOT23; FSK_PN: DMN3404L-7; MIFARE: X; MIFARE_CUSTOMERPN: Q/DMN3404/SOT23; MIFARE_PN: DMN3404L-7; PSK: X; PSK_CUSTOMERPN: Q/DMN3404/SOT23; PSK_PN: DMN3404L-7
Q2 Q4-Q7 = RFiD:MMBT4401; ASK: X; ASK_CUSTOMERPN: Q/MMBT4401/SOT23; ASK_PN: MMBT4401LT3G; FSK: X; FSK_CUSTOMERPN: Q/MMBT4401/SOT23; FSK_PN: MMBT4401LT3G; MIFARE: X; MIFARE_CUSTOMERPN: Q/MMBT4401/SOT23; MIFARE_PN: MMBT4401LT3G; PSK: X; PSK_CUSTOMERPN: Q/MMBT4401/SOT23; PSK_PN: MMBT4401LT3G
Q3 = RFiD:MMBT4403; ASK: X; ASK_CUSTOMERPN: Q/MMBT4403/SOT23; ASK_PN: MMBT4403LT3G; FSK: X; FSK_CUSTOMERPN: Q/MMBT4403/SOT23; FSK_PN: MMBT4403LT3G; MIFARE: X; MIFARE_CUSTOMERPN: Q/MMBT4403/SOT23; MIFARE_PN: MMBT4403LT3G; PSK: X; PSK_CUSTOMERPN: Q/MMBT4403/SOT23; PSK_PN: MMBT4403LT3G
QZ1 = RFiD:CRYSTAL: CRYSTAL; ASK: X; ASK_CUSTOMERPN: XTAL/8MHZ/PTH; ASK_PN: 9B-8.000MAAJ-B; FSK: X; FSK_CUSTOMERPN: XTAL/8MHZ/PTH; FSK_PN: 9B-8.000MAAJ-B; MIFARE: X; MIFARE_CUSTOMERPN: XTAL/8MHZ/PTH; MIFARE_PN: 9B-8.000MAAJ-B; PSK: X; PSK_CUSTOMERPN: XTAL/8MHZ/PTH; PSK_PN: 9B-8.000MAAJ-B
QZ2 = RFiD:CRISTAL: Monolithic Crystal Filters Source: www.vanlong.com; MIFARE: X; MIFARE_CUSTOMERPN: XTAL/2712MHZ/5x3; MIFARE_PN: 7B-27.120MAAJ-T
R1 R2 = RFiD:R-US_: RESISTOR, American symbol; ASK: X; ASK_CUSTOMERPN: R/470/5%/04; ASK_PN: RC1005J471CS; FSK: X; FSK_CUSTOMERPN: R/470/5%/04; FSK_PN: RC1005J471CS; MIFARE: X; MIFARE_CUSTOMERPN: R/470/5%/04; MIFARE_PN: RC1005J471CS; PASSIVO: Sim; PSK: X; PSK_CUSTOMERPN: R/470/5%/04; PSK_PN: RC1005J471CS
R3 = RFiD:R-US_: RESISTOR, American symbol; ASK: X; ASK_CUSTOMERPN: R/12K/5%/04; ASK_PN: RC1005J123CS; FSK: X; FSK_CUSTOMERPN: R/12K/5%/04; FSK_PN: RC1005J123CS; MIFARE: X; MIFARE_CUSTOMERPN: R/12K/5%/04; MIFARE_PN: RC1005J123CS; PASSIVO: Sim; PSK: X; PSK_CUSTOMERPN: R/12K/5%/04; PSK_PN: RC1005J123CS
R4 R17 R50 R51 R56 R63 = RFiD:R-US_: RESISTOR, American symbol; ASK: X; ASK_CUSTOMERPN: R/1K/5%/04; ASK_PN: RC0402JR-071KL; FSK: X; FSK_CUSTOMERPN: R/1K/5%/04; FSK_PN: RC0402JR-071KL; MIFARE: X; MIFARE_CUSTOMERPN: R/1K/5%/04; MIFARE_PN: RC0402JR-071KL; PASSIVO: Sim; PSK: X; PSK_CUSTOMERPN: R/1K/5%/04; PSK_PN: RC0402JR-071KL
R5 R7 = RFiD:R-US_: RESISTOR, American symbol; ASK: X; ASK_CUSTOMERPN: R/4.7k/5%/04; ASK_PN: RC0402JR-074K7L; FSK: X; FSK_CUSTOMERPN: R/4.7k/5%/04; FSK_PN: RC0402JR-074K7L; MIFARE: X; MIFARE_CUSTOMERPN: R/4.7k/5%/04; MIFARE_PN: RC0402JR-074K7L; PASSIVO: Sim; PSK: X; PSK_CUSTOMERPN: R/4.7k/5%/04; PSK_PN: RC0402JR-074K7L
R6 R48 R49 R55 R62 = RFiD:R-US_: RESISTOR, American symbol; ASK: X; ASK_CUSTOMERPN: R/2.2k/5%/04; ASK_PN: RC1005J222CS; FSK: X; FSK_CUSTOMERPN: R/2.2k/5%/04; FSK_PN: RC1005J222CS; MIFARE: X; MIFARE_CUSTOMERPN: R/2.2k/5%/04; MIFARE_PN: RC1005J222CS; PASSIVO: Sim; PSK: X; PSK_CUSTOMERPN: R/2.2k/5%/04; PSK_PN: RC1005J222CS
R8 R24 R33 = RFiD:R-US_: RESISTOR, American symbol; ASK: X; ASK_CUSTOMERPN: R/0/0%/04; ASK_PN: RC1005J000CS; FSK: X; FSK_CUSTOMERPN: R/0/0%/04; FSK_PN: RC1005J000CS; MIFARE: X; MIFARE_CUSTOMERPN: R/0/0%/04; MIFARE_PN: RC1005J000CS; PASSIVO: Sim; PSK: X; PSK_CUSTOMERPN: R/0/0%/04; PSK_PN: RC1005J000CS
R9 R10 = RFiD:R-US_: RESISTOR, American symbol; ASK: X; ASK_CUSTOMERPN: R/10/5%/06; ASK_PN: RC1608J100CS; FSK: X; FSK_CUSTOMERPN: R/10/5%/06; FSK_PN: RC1608J100CS; MIFARE: X; MIFARE_CUSTOMERPN: R/10/5%/06; MIFARE_PN: RC1608J100CS; PASSIVO: Sim; PSK: X; PSK_CUSTOMERPN: R/10/5%/06; PSK_PN: RC1608J100CS
R11 R13 = RFiD:R-US_: RESISTOR, American symbol; ASK: X; ASK_CUSTOMERPN: R/91k/5%/04; ASK_PN: RC1005J913CS; FSK: X; FSK_CUSTOMERPN: R/91k/5%/04; FSK_PN: RC1005J913CS; MIFARE: X; MIFARE_CUSTOMERPN: R/91k/5%/04; MIFARE_PN: RC1005J913CS; PASSIVO: Sim; PSK: X; PSK_CUSTOMERPN: R/91k/5%/04; PSK_PN: RC1005J913CS
R12 R14 R25 = RFiD:R-US_: RESISTOR, American symbol; ASK: X; ASK_CUSTOMERPN: R/13k/5%/04; ASK_PN: RC1005J133CS; FSK: X; FSK_CUSTOMERPN: R/13k/5%/04; FSK_PN: RC1005J133CS; MIFARE: X; MIFARE_CUSTOMERPN: R/13k/5%/04; MIFARE_PN: RC1005J133CS; PASSIVO: Sim; PSK: X; PSK_CUSTOMERPN: R/13k/5%/04; PSK_PN: RC1005J133CS
R15 = RFiD:R-US_: RESISTOR, American symbol; ASK: X; ASK_CUSTOMERPN: R/1M/5%/12; ASK_PN: RC3216J105CS; FSK: X; FSK_CUSTOMERPN: R/1M/5%/12; FSK_PN: RC3216J105CS; MIFARE: X; MIFARE_CUSTOMERPN: R/1M/5%/12; MIFARE_PN: RC3216J105CS; PASSIVO: Sim; PSK: X; PSK_CUSTOMERPN: R/1M/5%/12; PSK_PN: RC3216J105CS
R16 R58-R61 = RFiD:R-US_: RESISTOR, American symbol; ASK: X; ASK_CUSTOMERPN: R/100K/5%/06; ASK_PN: RC0603JR-07100KL; FSK: X; FSK_CUSTOMERPN: R/100K/5%/06; FSK_PN: RC0603JR-07100KL; MIFARE: X; MIFARE_CUSTOMERPN: R/100K/5%/06; MIFARE_PN: RC0603JR-07100KL; PASSIVO: Sim; PSK: X; PSK_CUSTOMERPN: R/100K/5%/06; PSK_PN: RC0603JR-07100KL
R18 = RFiD:R-US_: RESISTOR, American symbol; ASK: X; ASK_CUSTOMERPN: R/27k/1%/04; ASK_PN: RC1005F273CS; FSK: X; FSK_CUSTOMERPN: R/27k/1%/04; FSK_PN: RC1005F273CS; MIFARE: X; MIFARE_CUSTOMERPN: R/27k/1%/04; MIFARE_PN: RC1005F273CS; PASSIVO: Sim; PSK: X; PSK_CUSTOMERPN: R/27k/1%/04; PSK_PN: RC1005F273CS
R19 R20 R22 = RFiD:R-US_: RESISTOR, American symbol; ASK: X; ASK_CUSTOMERPN: R/9.1k/5%/04; ASK_PN: RC1005J912CS; FSK: X; FSK_CUSTOMERPN: R/9.1k/5%/04; FSK_PN: RC1005J912CS; MIFARE: X; MIFARE_CUSTOMERPN: R/9.1k/5%/04; MIFARE_PN: RC1005J912CS; PASSIVO: Sim; PSK: X; PSK_CUSTOMERPN: R/9.1k/5%/04; PSK_PN: RC1005J912CS
R21 R35 R40 = RFiD:R-US_: RESISTOR, American symbol; FSK: X; FSK_CUSTOMERPN: R/5.1k/5%/04; FSK_PN: RC1005F512CS; PASSIVO: Sim; PSK: X; PSK_CUSTOMERPN: R/5.6k/5%/04; PSK_PN: RC1005F562CS
R23 R36 R39 = RFiD:R-US_: RESISTOR, American symbol; FSK: X; FSK_CUSTOMERPN: R/7.5k/5%/04; FSK_PN: RC1005F752CS; PASSIVO: Sim; PSK: X; PSK_CUSTOMERPN: R/5.1k/5%/04; PSK_PN: RC1005F512CS
R26 = RFiD:R-US_: RESISTOR, American symbol; FSK: X; FSK_CUSTOMERPN: R/9.1k/5%/04; FSK_PN: RC1005J912CS; PASSIVO: Sim; PSK: X; PSK_CUSTOMERPN: R/9.1k/5%/04; PSK_PN: RC1005J912CS
R27 R31 R41 = RFiD:R-US_: RESISTOR, American symbol; FSK: X; FSK_CUSTOMERPN: R/180k/5%/04; FSK_PN: RC1005J184CS; PASSIVO: Sim; PSK: X; PSK_CUSTOMERPN: R/270k/5%/04; PSK_PN: RC1005F274CS
R28 R30 R32 R34 R37 = RFiD:R-US_: RESISTOR, American symbol; FSK: X; FSK_CUSTOMERPN: R/27k/1%/04; FSK_PN: RC1005F273CS; PASSIVO: Sim; PSK: X; PSK_CUSTOMERPN: R/27k/1%/04; PSK_PN: RC1005F273CS
R29 = RFiD:R-US_: RESISTOR, American symbol; FSK: X; FSK_CUSTOMERPN: R/470/5%/04; FSK_PN: RC1005J471CS; PASSIVO: Sim; PSK: X; PSK_CUSTOMERPN: R/470/5%/04; PSK_PN: RC1005J471CS
R38 = RFiD:R-US_: RESISTOR, American symbol; FSK: X; FSK_CUSTOMERPN: R/100/5%/06; FSK_PN: RC1608J101CS; PASSIVO: Sim; PSK: X; PSK_CUSTOMERPN: R/100/5%/06; PSK_PN: RC1608J101CS
R42 R43 = RFiD:R-US_: RESISTOR, American symbol; MIFARE: X; MIFARE_CUSTOMERPN: R/4.7K/5%/04; MIFARE_PN: RC0402JR-074K7L; PASSIVO: Sim
R44 = RFiD:R-US_: RESISTOR, American symbol; MIFARE: X; MIFARE_CUSTOMERPN: R/1K/5%/04; MIFARE_PN: RC0402JR-071KL; PASSIVO: Sim
R45 = RFiD:R-US_: RESISTOR, American symbol; MIFARE: X; MIFARE_CUSTOMERPN: R/2.2k/5%/04; MIFARE_PN: RC1005J222CS; PASSIVO: Sim
R46 R47 = RFiD:R-US_: RESISTOR, American symbol; MIFARE: X; MIFARE_CUSTOMERPN: R/3.3/5%/06; MIFARE_PN: RC1608J3R3CS; PASSIVO: Sim
R52 R57 R64 = RFiD:R-US_: RESISTOR, American symbol; ASK: X; ASK_CUSTOMERPN: R/100/5%/06; ASK_PN: RC1608J101CS; FSK: X; FSK_CUSTOMERPN: R/100/5%/06; FSK_PN: RC1608J101CS; MIFARE: X; MIFARE_CUSTOMERPN: R/100/5%/06; MIFARE_PN: RC1608J101CS; PASSIVO: Sim; PSK: X; PSK_CUSTOMERPN: R/100/5%/06; PSK_PN: RC1608J101CS
R53 = RFiD:R-US_: RESISTOR, American symbol; ASK: X; ASK_CUSTOMERPN: R/130/5%/04; ASK_PN: RC1005J131CS; FSK: X; FSK_CUSTOMERPN: R/130/5%/04; FSK_PN: RC1005J131CS; MIFARE: X; MIFARE_CUSTOMERPN: R/130/5%/04; MIFARE_PN: RC1005J131CS; PASSIVO: Sim; PSK: X; PSK_CUSTOMERPN: R/130/5%/04; PSK_PN: RC1005J131CS
R54 = RFiD:R-US_: RESISTOR, American symbol; ASK: X; ASK_CUSTOMERPN: R/120/5%/04; ASK_PN: RC1005J121CS; FSK: X; FSK_CUSTOMERPN: R/120/5%/04; FSK_PN: RC1005J121CS; MIFARE: X; MIFARE_CUSTOMERPN: R/120/5%/04; MIFARE_PN: RC1005J121CS; PASSIVO: Sim; PSK: X; PSK_CUSTOMERPN: R/120/5%/04; PSK_PN: RC1005J121CS
SWD = RFiD:PINHD-1X5: PIN HEADER
U1 = RFiD:LP2985-33DBVR; ASK: X; ASK_CUSTOMERPN: IC/3V3REG; ASK_PN: TLV71333PDBVR; FSK: X; FSK_CUSTOMERPN: IC/3V3REG; FSK_PN: TLV71333PDBVR; MIFARE: X; MIFARE_CUSTOMERPN: IC/3V3REG; MIFARE_PN: TLV71333PDBVR; PSK: X; PSK_CUSTOMERPN: IC/3V3REG; PSK_PN: TLV71333PDBVR
U2 = RFiD:TLV1117-50CDCYR; ASK: X; ASK_CUSTOMERPN: IC/5VREG; ASK_PN: NCP1117LPST50T3G; FSK: X; FSK_CUSTOMERPN: IC/5VREG; FSK_PN: NCP1117LPST50T3G; MIFARE: X; MIFARE_CUSTOMERPN: IC/5VREG; MIFARE_PN: NCP1117LPST50T3G; PSK: X; PSK_CUSTOMERPN: IC/5VREG; PSK_PN: NCP1117LPST50T3G
U3 = RFiD:SAMD20E14A-AUT: ATSAMD20E edit this description The Atmel® SAM D20 family is a series of low-power, high-performance, ARM®-based embedded flash microcontrollers based on the ARM Cortex®-M0+ 32-bit processor. Operating at a maximum speed of 48MHz, and with a two-stage pipeline, single-cycle I/O access, single-cycle 32x32 multiplier, Event System and a fast and flexible interrupt controller, the SAM D20 series microcontrollers are highly efficient, reaching 2.14 Coremark/MHz – 0.93 DMIPS/MHz.; ASK: X; ASK_CUSTOMERPN: IC/SAMD20/TQ32; ASK_PN: SAMD20E14A-AUT; FSK: X; FSK_CUSTOMERPN: IC/SAMD20/TQ32; FSK_PN: SAMD20E14A-AUT; MIFARE: X; MIFARE_CUSTOMERPN: IC/SAMD20/TQ32; MIFARE_PN: SAMD20E14A-AUT; PSK: X; PSK_CUSTOMERPN: IC/SAMD20/TQ32; PSK_PN: SAMD20E14A-AUT
U4 = RFiD:MFRC52202HN1: Connect-List generated from MFRC522.DEV Variant '' with split-device-symbol.ulp; MIFARE: X; MIFARE_CUSTOMERPN: IC/MFRC52202; MIFARE_PN: MFRC52202HN1,151
X1 = RFiD:22-23-2021: .100" (2.54mm) Center Header - 2 Pin
X2 = RFiD:ANTENA